# EAGLE schematic HVSupply (EAGLE 7.1.0)
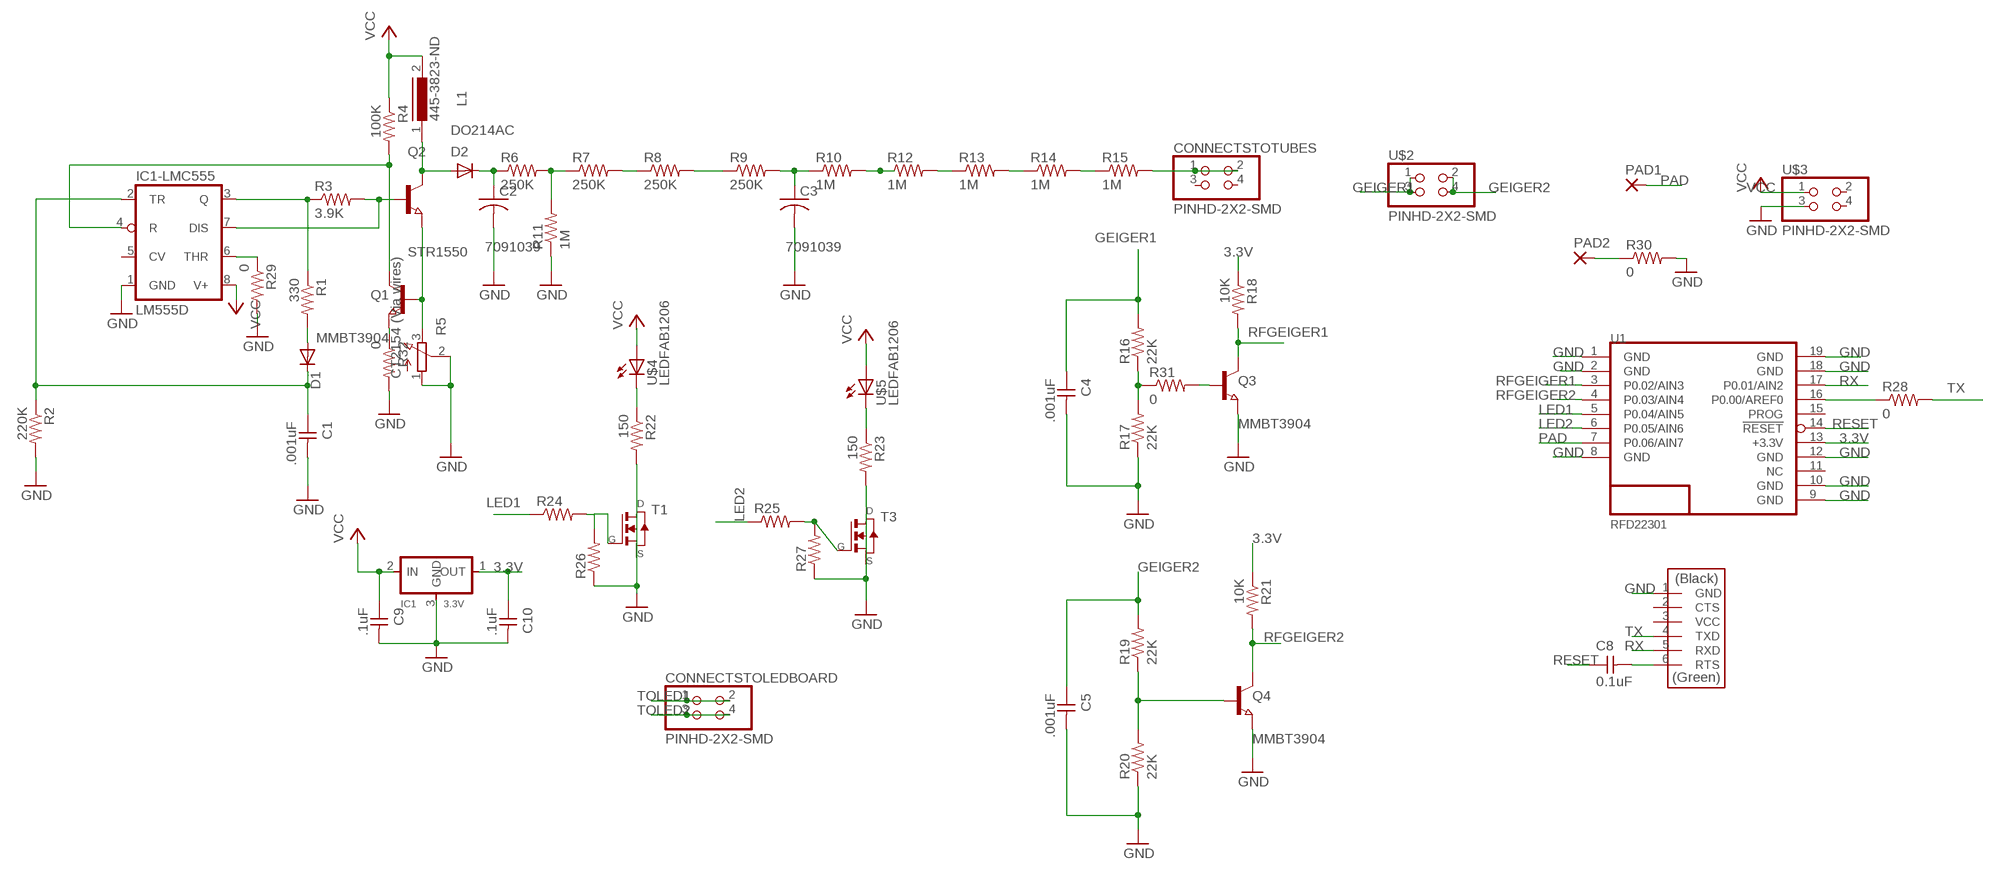
[diagram p0: schematic, sheet 1]

## Parts
C1  .001uF  CAP-UNPOLARIZEDFAB  [C1206FAB]
C2  7091039  C-USC0603K  [C0603K]
C3  7091039  C-USC0603K  [C0603K]
C4  .001uF  CAP-UNPOLARIZEDFAB  [C1206FAB]
C5  .001uF  CAP-UNPOLARIZEDFAB  [C1206FAB]
C8  0.1uF  CAP-UNPOLARIZEDFAB  [C1206FAB]
C9  .1uF  CAP-UNPOLARIZEDFAB  [C1206FAB]
C10  .1uF  CAP-UNPOLARIZEDFAB  [C1206FAB]
CONNECTSTOLEDBOARD  PINHD-2X2-SMD  [2X02SMD]
CONNECTSTOTUBES  PINHD-2X2-SMD  [2X02SMD]
D1  DIODESOD123  [SOD123]
D2  DO214AC  GF1  [SMA-DO214AC]
IC1  3.3V  REGULATORSOT23  [SOT23]
IC1-LMC555  LM555D  [SO08]
L1  445-3823-ND  EMC9714  [EMC9714]
PAD1  SMD5  [SMD2,54-5,08]
PAD2  SMD5  [SMD2,54-5,08]
Q1  MMBT3904  NPN-TRANSISTOR_SOT23  [SOT23]
Q2  STR1550  NPN-TRANSISTOR_SOT23  [SOT23]
Q3  MMBT3904  NPN-TRANSISTOR_SOT23  [SOT23]
Q4  MMBT3904  NPN-TRANSISTOR_SOT23  [SOT23]
R1  330  RES-US1206FAB  [R1206FAB]
R2  220K  RES-US1206FAB  [R1206FAB]
R3  3.9K  RES-US1206FAB  [R1206FAB]
R4  100K  RES-US1206FAB  [R1206FAB]
R5  CT2154 (Via wires)  3RP/1610N  [3RP/1610N]
R6  250K  RES-US1206FAB  [R1206FAB]
R7  250K  RES-US1206FAB  [R1206FAB]
R8  250K  RES-US1206FAB  [R1206FAB]
R9  250K  RES-US1206FAB  [R1206FAB]
R10  1M  RES-US1206FAB  [R1206FAB]
R11  1M  RES-US1206FAB  [R1206FAB]
R12  1M  RES-US1206FAB  [R1206FAB]
R13  1M  RES-US1206FAB  [R1206FAB]
R14  1M  RES-US1206FAB  [R1206FAB]
R15  1M  RES-US1206FAB  [R1206FAB]
R16  22K  RES-US1206FAB  [R1206FAB]
R17  22K  RES-US1206FAB  [R1206FAB]
R18  10K  RES-US1206FAB  [R1206FAB]
R19  22K  RES-US1206FAB  [R1206FAB]
R20  22K  RES-US1206FAB  [R1206FAB]
R21  10K  RES-US1206FAB  [R1206FAB]
R22  150  RES-US1206FAB  [R1206FAB]
R23  150  RES-US1206FAB  [R1206FAB]
R24  RES-US1206FAB  [R1206FAB]
R25  RES-US1206FAB  [R1206FAB]
R26  RES-US1206FAB  [R1206FAB]
R27  RES-US1206FAB  [R1206FAB]
R28  0  RES-US1206FAB  [R1206FAB]
R29  0  RES-US1206FAB  [R1206FAB]
R30  0  RES-US1206FAB  [R1206FAB]
R31  0  RES-US1206FAB  [R1206FAB]
R32  0  RES-US1206FAB  [R1206FAB]
T1  NMOSFETSOT23  [SOT-23]
T3  NMOSFETSOT23  [SOT-23]
U1  RFD22301  [RFD22301]
U$1  FTDI-SMD-HEADER  [1X06SMD]
U$2  PINHD-2X2-SMD  [2X02SMD]
U$3  PINHD-2X2-SMD  [2X02SMD]
U$4  LEDFAB1206  [LED1206FAB]
U$5  LEDFAB1206  [LED1206FAB]

## Nets
3.3V: C10.1 IC1.1(OUT) R18.1 R21.1 U1.13(+3.3V)
GEIGER1: C4.1 R16.2 U$2.1 U$2.3
GEIGER2: C5.1 R19.2 U$2.2 U$2.4
GND: C1.2 C2.2 C3.2 C4.2 C5.2 C9.2 C10.2 IC1-LMC555.1(GND) IC1.3(GND) Q3.2(E) Q4.2(E) R2.2 R5.1(A) R5.2(S) R11.1 R17.1 R20.1 R26.1 R27.1 R29.2 R30.2 R32.2 T1.1(D) T3.1(D) U1.1(GND) U1.2(GND) U1.8(GND) U1.9(GND) U1.10(GND) U1.12(GND) U1.18(GND) U1.19(GND) U$1.1(GND) U$3.3
LED1: R24.1 U1.5(P0.04/AIN5)
LED2: R25.1 U1.6(P0.05/AIN6)
N$1: C1.1 D1.CATHODE(C) IC1-LMC555.2(TR) R2.1
N$2: D1.ANODE(A) R1.2
N$3: C8.2 U$1.6(RTS)
N$4: IC1-LMC555.3(Q) R1.1 R3.1
N$5: Q1.1(B) Q2.2(E) R5.3(E)
N$6: D2.A L1.1 Q2.3(C)
N$7: C2.1 D2.K(C) R6.1
N$8: R6.2 R7.1 R11.2
N$9: R7.2 R8.1
N$10: R8.2 R9.1
N$11: C3.1 R9.2 R10.1
N$12: R10.2 R12.1
N$13: R12.2 R13.1
N$14: R13.2 R14.1
N$15: R14.2 R15.1
N$16: CONNECTSTOTUBES.1 CONNECTSTOTUBES.2 R15.2
N$18: Q4.1(B) R19.1 R20.2
N$19: R16.1 R17.2 R31.1
N$20: R24.2 R26.2 T1.3(G)
N$22: R28.1 U1.16(P0.00/AREF0)
N$23: IC1-LMC555.7(DIS) Q2.1(B) R3.2
N$24: IC1-LMC555.4(R) Q1.3(C) R4.2
N$25: R25.2 R27.2 T3.3(G)
N$26: IC1-LMC555.6(THR) R29.1
N$27: PAD2.1(P) R30.1
N$28: Q3.1(B) R31.2
N$29: Q1.2(E) R32.1
N$30: U$4.1(A)
N$31: R22.1 U$4.2(C)
N$32: R23.1 U$5.2(C)
PAD: PAD1.1(P) U1.7(P0.06/AIN7)
RESET: C8.1 U1.14(!RESET)
RFGEIGER1: Q3.3(C) R18.2 U1.3(P0.02/AIN3)
RFGEIGER2: Q4.3(C) R21.2 U1.4(P0.03/AIN4)
RX: U1.17(P0.01/AIN2) U$1.5(RXD)
TOLED1: CONNECTSTOLEDBOARD.1 CONNECTSTOLEDBOARD.2 R22.2 T1.2(S)
TOLED2: CONNECTSTOLEDBOARD.3 CONNECTSTOLEDBOARD.4 R23.2 T3.2(S)
TX: R28.2 U$1.4(TXD)
VCC: C9.1 IC1-LMC555.8(V+) IC1.2(IN) L1.2 R4.1 U$3.1 U$5.1(A)
Unconnected: CONNECTSTOTUBES.3 CONNECTSTOTUBES.4 IC1-LMC555.5(CV) U1.11(NC) U1.15(PROG) U$1.2(CTS) U$1.3(VCC) U$3.2 U$3.4

## Library data of the parts
C1 C4 C5 C8-C10 = fab_copy:CAP-UNPOLARIZED
C2 C3 = rcl:C-US: CAPACITOR, American symbol
CONNECTSTOLEDBOARD CONNECTSTOTUBES U$2 U$3 = fab_copy:PINHD-2X2-SMD
D1 = fab_copy:DIODE: DIODE high speed (Philips)
D2 = diode:GF1: DIODE
IC1 = fab_copy:REGULATOR
IC1-LMC555 = adafruit:*555: TIMER Changed DIP package to have round (not oval) pin pads http://www.ladyada.net/library/pcb/eaglelibrary.html
L1 = inductors:EMC9714: INDUCTOR
PAD1 PAD2 = wirepad:SMD5: SMD PAD
Q1-Q4 = semicon-smd-ipc:NPN-TRANSISTOR_: NPN TRANSISTOR
R1-R4 R6-R32 = fab_copy:RES-US: Resistor (US Symbol) Variants with postfix FAB are widened to allow the routing of internal traces
R5 = pot:3RP/1610N: 16mm Potentiometer one level Source: http://www.alphapotentiometers.net/html/16mm_pot_2.html
T1 T3 = fab_copy:NMOSFET: MOS FET
U1 = Ai_RF:RFD22301: RF Digital RFD22301
U$1 = fab_copy:FTDI-SMD-HEADER
U$4 U$5 = fab_copy:LED: LED